# EAGLE design Payload (EAGLE 9.3.0)
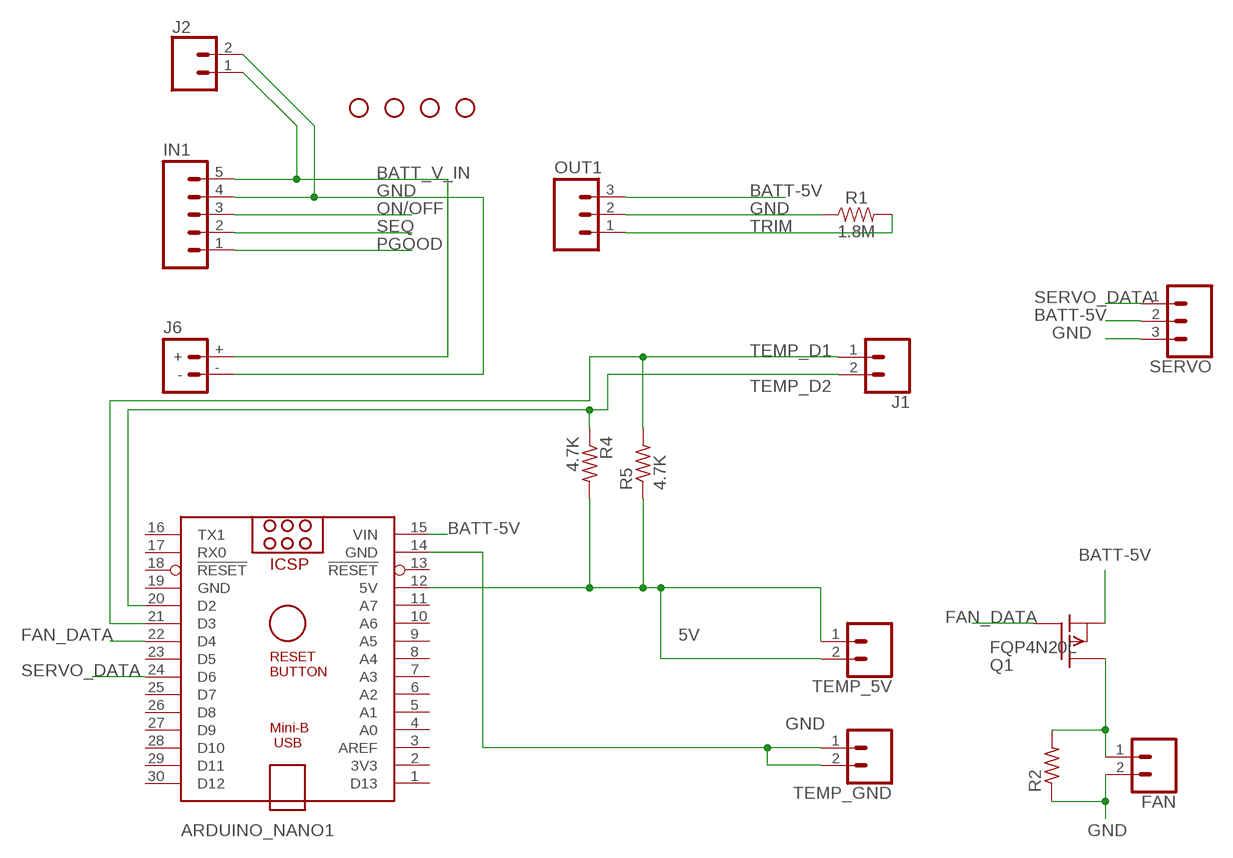
[diagram p0: schematic, sheet 1]

## Parts
ARDUINO_NANO1  ARDUINO_NANO  [ARDUINO_NANO]
FAN  CONN_023.5MM  [SCREWTERMINAL-3.5MM-2]
IN1  M05PTH  [1X05]
J1  CONN_023.5MM  [SCREWTERMINAL-3.5MM-2]
J2  CONN_023.5MM  [SCREWTERMINAL-3.5MM-2]
J6  BATTERY_CONN_DEANS  [DEANS]
OUT1  M03PTH  [1X03]
Q1  FQP4N20L  IRF9530  [TO220]
R1  1.8M  1.8MOHM  [0603]
R2  R-US_0207/10  [0207/10]
R4  4.7K  R-US_0207/10  [0207/10]
R5  4.7K  R-US_0207/10  [0207/10]
SERVO  CONN_03  [1X03]
TEMP_5V  CONN_023.5MM  [SCREWTERMINAL-3.5MM-2]
TEMP_GND  CONN_023.5MM  [SCREWTERMINAL-3.5MM-2]
U$2  STAND-OFF  [STAND-OFF]
U$6  STAND-OFF  [STAND-OFF]
U$7  STAND-OFF  [STAND-OFF]
U$8  STAND-OFF  [STAND-OFF]

## Nets
5V: ARDUINO_NANO1.12(5V) R4.2 R5.1 TEMP_5V.1 TEMP_5V.2
BATT-5V: ARDUINO_NANO1.15(VIN) OUT1.3 Q1.3(S) SERVO.2
BATT_V_IN: IN1.5 J2.1 J6.+
FAN_DATA: ARDUINO_NANO1.22(D4) Q1.1(G)
GND: ARDUINO_NANO1.14(GND) FAN.2 IN1.4 J2.2 J6.- OUT1.2 R1.1 R2.1 SERVO.3 TEMP_GND.1 TEMP_GND.2
N$2: FAN.1 Q1.2(D) R2.2
ON/OFF: IN1.3
PGOOD: IN1.1
SEQ: IN1.2
SERVO_DATA: ARDUINO_NANO1.24(D6) SERVO.1
TEMP_D1: ARDUINO_NANO1.21(D3) J1.1 R5.2
TEMP_D2: ARDUINO_NANO1.20(D2) J1.2 R4.1
TRIM: OUT1.1 R1.2
Unconnected: ARDUINO_NANO1.1(D13) ARDUINO_NANO1.2(3V3) ARDUINO_NANO1.3(AREF) ARDUINO_NANO1.4(A0) ARDUINO_NANO1.5(A1) ARDUINO_NANO1.6(A2) ARDUINO_NANO1.7(A3) ARDUINO_NANO1.8(A4) ARDUINO_NANO1.9(A5) ARDUINO_NANO1.10(A6) ARDUINO_NANO1.11(A7) ARDUINO_NANO1.13(!RESET) ARDUINO_NANO1.16(TX1) ARDUINO_NANO1.17(RX0) ARDUINO_NANO1.18(!RESET) ARDUINO_NANO1.23(D5) ARDUINO_NANO1.25(D7) ARDUINO_NANO1.26(D8) ARDUINO_NANO1.27(D9) ARDUINO_NANO1.28(D10) ARDUINO_NANO1.29(D11) ARDUINO_NANO1.30(D12)

## Power pins joined to a net without a drawn wire
GND: ARDUINO_NANO1.19(GND)

## Library data of the parts
ARDUINO_NANO1 = ArduinoNanoV30:ARDUINO_NANO: Arduino Nano V3.0 Overview: The Arduino Nano is a small, complete, and breadboard-friendly board based on the ATmega328 (Arduino Nano 3.x) or ATmega168 (Arduino Nano 2.x). It has more or less the same functionality of the Arduino Duemilanove, but in a different package. It lacks only a DC power jack, and works with a Mini-B USB cable instead of a standard one. The Nano was designed and is being produced by Gravitech. Specifications: Microcontroller Atmel ATmega168 or ATmega328 Operating Voltage (logic level) 5 V Input Voltage (recommended) 7-12 V Input Voltage (limits) 6-20 V Digital I/O Pins 14 (of which 6 provide PWM output) Analog Input Pins 8 DC Current per I/O Pin 40 mA Flash Memory 16 KB (ATmega168) or 32 KB (ATmega328) of which 2 KB used by bootloader SRAM 1 KB (ATmega168) or 2 KB (ATmega328) EEPROM 512 bytes (ATmega168) or 1 KB (ATmega328) Clock Speed 16 MHz Dimensions 0.73" x 1.70" Length 45 mm Width 18 mm Weigth 5 g Power: The Arduino Nano can be powered via the Mini-B USB connection, 6-20V unregulated external power supply (pin 30), or 5V regulated external power supply (pin 27). The power source is automatically selected to the highest voltage source. Memory: The ATmega168 has 16 KB of flash memory for storing code (of which 2 KB is used for the bootloader); the ATmega328 has 32 KB, (also with 2 KB used for the bootloader). The ATmega168 has 1 KB of SRAM and 512 bytes of EEPROM (which can be read and written with the EEPROM library); the ATmega328 has 2 KB of SRAM and 1 KB of EEPROM. Input and Output: Each of the 14 digital pins on the Nano can be used as an input or output, using pinMode(), digitalWrite(), and digitalRead() functions. They operate at 5 volts. Each pin can provide or receive a maximum of 40 mA and has an internal pull-up resistor (disconnected by default) of 20-50 kOhms. In addition, some pins have specialized functions. Visit Arduino - ArduinoBoardNano <https://www.arduino.cc/en/Main/ArduinoBoardNano>
FAN J1 J2 TEMP_5V TEMP_GND = SparkFun-Connectors:CONN_02: Multi connection point. Often used as Generic Header-pin footprint for 0.1 inch spaced/style header connections On any of the 0.1 inch spaced packages, you can populate with these: Break Away Headers - Straight <https://www.sparkfun.com/products/116> (PRT-00116) Break Away Male Headers - Right Angle <https://www.sparkfun.com/products/553> (PRT-00553) Female Headers <https://www.sparkfun.com/products/115> (PRT-00115) Break Away Headers - Machine Pin <https://www.sparkfun.com/products/117> (PRT-00117) Break Away Female Headers - Swiss Machine Pin <https://www.sparkfun.com/products/743> (PRT-00743) For SCREWTERMINALS and SPRING TERMINALS visit here: Screw Terimnals on SparkFun.com <https://www.sparkfun.com/search/results?term=Screw+Terminals> (5mm/3.5mm/2.54mm spacing) This device is also useful as a general connection point to wire up your design to another part of your project. Our various solder wires solder well into these plated through hole pads. Hook-Up Wire - Assortment (Stranded, 22 AWG) <https://www.sparkfun.com/products/11375> (PRT-11375) Hook-Up Wire - Assortment (Solid Core, 22 AWG) <https://www.sparkfun.com/products/11367> (PRT-11367) View the entire wire category on our website here <https://www.sparkfun.com/categories/141> Special notes: Molex polarized connector foot print use with: PRT-08233 with associated crimp pins and housings. 2.54_SCREWTERM for use with PRT-10571. 3.5mm Screw Terminal footprints for PRT-08084 5mm Screw Terminal footprints for use with PRT-08432; PROD_ID: CONN-08399
IN1 = SparkFun:M05: Header 5 Standard 5-pin 0.1" header. Use with straight break away headers (SKU : PRT-00116), right angle break away headers (PRT-00553), swiss pins (PRT-00743), machine pins (PRT-00117), and female headers (PRT-00115). Molex polarized connector foot print use with SKU : PRT-08230 with associated crimp pins and housings.
J6 = SparkFun-Connectors:BATTERY_CONN: Battery Connectors Various footprints for battery connections SparkFun Products: Deans Connector -M/F Pair <https://www.sparkfun.com/products/11864>; SF_ID: PRT-11864
OUT1 = SparkFun:M03: Header 3 Standard 3-pin 0.1" header. Use with straight break away headers (SKU : PRT-00116), right angle break away headers (PRT-00553), swiss pins (PRT-00743), machine pins (PRT-00117), and female headers (PRT-00115). Molex polarized connector foot print use with SKU : PRT-08232 with associated crimp pins and housings.
Q1 = transistor-fet:IRF9530: P-Channel Enhancement MOSFET (HEXFET); -100V; -12A; 0,3Ohm; SPICEPREFIX: Q
R1 = SparkFun-Resistors:1.8MOHM: 1.8 MOhms ±5% 0.1W, 1/10W Chip Resistor 0603; PROD_ID: RES-13994
R2 R4 R5 = rcl:R-US_: RESISTOR, American symbol; SPICEPREFIX: R
SERVO = SparkFun-Connectors:CONN_03: Multi connection point. Often used as Generic Header-pin footprint for 0.1 inch spaced/style header connections On any of the 0.1 inch spaced packages, you can populate with these: Break Away Headers - Straight <https://www.sparkfun.com/products/116> (PRT-00116) Break Away Male Headers - Right Angle <https://www.sparkfun.com/products/553> (PRT-00553) Female Headers <https://www.sparkfun.com/products/115> (PRT-00115) Break Away Headers - Machine Pin <https://www.sparkfun.com/products/117> (PRT-00117) Break Away Female Headers - Swiss Machine Pin <https://www.sparkfun.com/products/743> (PRT-00743) Stackable Header - 3 Pin (Female, 0.1") <https://www.sparkfun.com/products/13875> (PRT-13875) For SCREWTERMINALS and SPRING TERMINALS visit here: Screw Terimnals on SparkFun.com <https://www.sparkfun.com/search/results?term=Screw+Terminals> (5mm/3.5mm/2.54mm spacing) This device is also useful as a general connection point to wire up your design to another part of your project. Our various solder wires solder well into these plated through hole pads. Hook-Up Wire - Assortment (Stranded, 22 AWG) <https://www.sparkfun.com/products/11375> (PRT-11375) Hook-Up Wire - Assortment (Solid Core, 22 AWG) <https://www.sparkfun.com/products/11367> (PRT-11367) View the entire wire category on our website here <https://www.sparkfun.com/categories/141> Special notes: Molex polarized connector foot print use with SKU : PRT-08232 with associated crimp pins and housings.; PROD_ID: XXX-00000; VALUE: 455-1750-1-ND
U$2 U$6-U$8 = SparkFun:STAND-OFF: Stand Off This is the mechanical footprint for a #4 phillips button head screw. Use the keepout ring to avoid running the screw head into surrounding components. SKU : PRT-00447

## Board
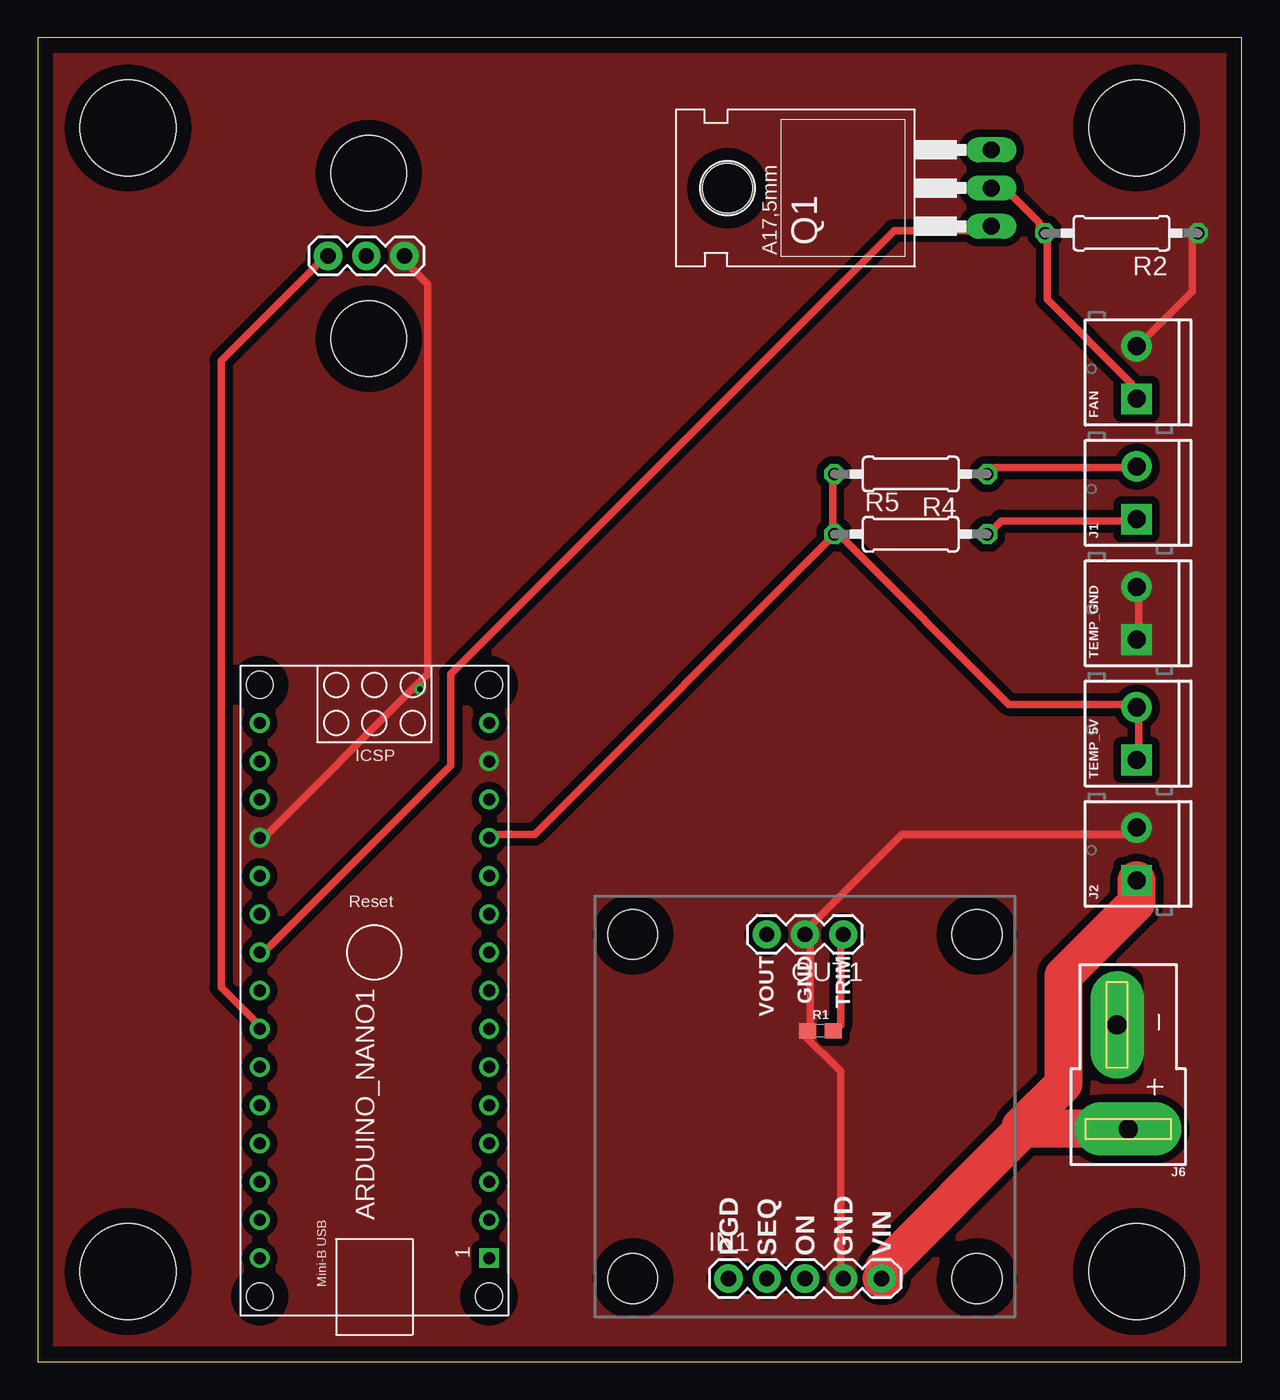
[diagram p1: board, top side]
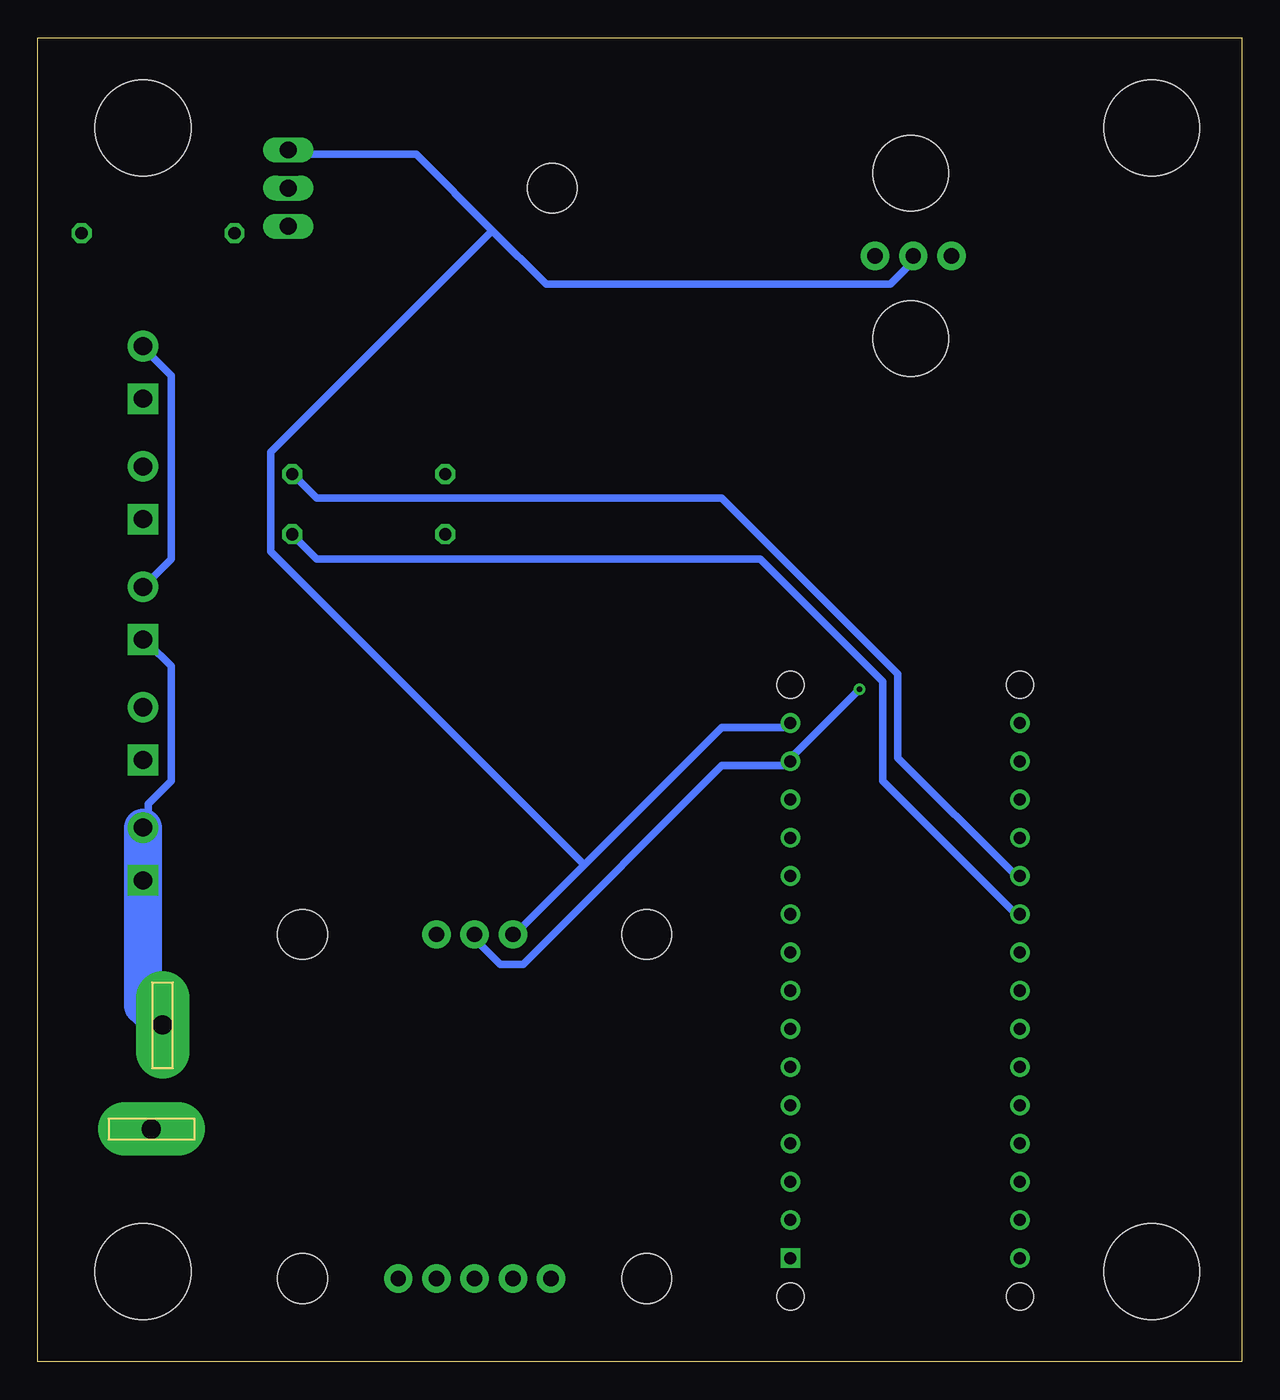
[diagram p2: board, bottom side, seen from below]

Size 80 x 88 mm. Coordinates in mm from the lower left corner, seen from the top.
Outline: 0,0 80,0 80,88 0,88 0,0
Copper layers (1*16): Top 0.035mm / dielectric 1.5mm / Bottom 0.035mm
Design rules "default *": minimum track width 20mil, minimum drill 0.35mm, track to track 20mil, track to pad 20mil, pad to pad 20mil, via to via 20mil, smd to smd 6mil, copper to edge 40mil, drill to drill 6mil, minimum pad ring 10mil, minimum via ring 8mil, stop-mask expansion 4mil, vias tented up to drill 0mil, thermal gap 10mil
Holes 5 mm at 22,79 22,68
Holes 6.35 mm at 6,82 73,82 73,6 6,6

### Footprints (pad centres in the part's own frame; a part is rotated, then mirrored left to right if it is on the bottom)
ARDUINO_NANO = drill 0.8 square: 1 -20.32,-7.62 | drill 0.8: 2 -17.78,-7.62; 3 -15.24,-7.62; 4 -12.7,-7.62; 5 -10.16,-7.62; 6 -7.62,-7.62; 7 -5.08,-7.62; 8 -2.54,-7.62; 9 0,-7.62; 10 2.54,-7.62; 11 5.08,-7.62; 12 7.62,-7.62; 13 10.16,-7.62; 14 12.7,-7.62; 15 15.24,-7.62; 16 15.24,7.62; 17 12.7,7.62; 18 10.16,7.62; 19 7.62,7.62; 20 5.08,7.62; 21 2.54,7.62; 22 0,7.62; 23 -2.54,7.62; 24 -5.08,7.62; 25 -7.62,7.62; 26 -10.16,7.62; 27 -12.7,7.62; 28 -15.24,7.62; 29 -17.78,7.62; 30 -20.32,7.62 | hole 1.778: -22.86,-7.62; -22.86,7.62; 17.78,7.62; 17.78,-7.62
SCREWTERMINAL-3.5MM-2 = drill 1.2 pad 2.032 square: 1 0,0 | drill 1.2 pad 2.032: 2 3.5,0
1X05 = drill 1.016 pad 1.88: 1 0,0; 2 2.54,0; 3 5.08,0; 4 7.62,0; 5 10.16,0
DEANS = drill 1.27 pad 3.556 long: + 0,0; - 0.737,-6.921
1X03 = drill 1.016 pad 1.88: 1 0,0; 2 2.54,0; 3 5.08,0
TO220 = drill 1.118 long: 1 -2.54,-6.35; 2 0,-6.35; 3 2.54,-6.35 | hole 3.302: 0,11.176
0603 = smd 1.1 x 1: 1 -0.85,0; 2 0.85,0
0207/10 = drill 0.813 octagon: 1 -5.08,0; 2 5.08,0
STAND-OFF = hole 3.302: 0,0

### Placement (x,y rotation side)
ARDUINO_NANO1  22.37,27.21 90 top
FAN  73,64 90 top
IN1  45.89,5.54 0 top
J1  73,56 90 top
J2  73,32 90 top
J6  72.44,15.47 180 top
OUT1  53.51,28.4 180 top
Q1  57,78 90 top
R1  52,22 0 top
R2  72,75 180 top
R4  58,59 180 top
R5  58,55 0 top
SERVO  19.29,73.5 0 top
TEMP_5V  73,40 90 top
TEMP_GND  73,48 90 top
U$2  39.54,5.54 0 top
U$6  62.4,5.54 0 top
U$7  39.54,28.4 0 top
U$8  62.4,28.4 0 top

### Tracks (layer width: path | path; a pad name or v marks a point on that pad's centre or on a via)
5V
  Top 0.508: TEMP_5V.1 73.15,40.13 73.15,43.18 TEMP_5V.2 72.64,43.69 64.52,43.69 53.34,54.86 R5.1 | ARDUINO_NANO1.12 30.48,35.05 33.02,35.05 52.83,54.86 R5.1 | R4.2 52.83,58.93 52.83,55.37 R5.1
BATT-5V
  Bottom 0.508: 43.69,33.02 48.26,28.45 OUT1.3 | 43.69,33.02 34.54,42.16 30.48,42.16 ARDUINO_NANO1.15 | 49.78,75.18 46.23,71.63 23.37,71.63 21.84,73.15 SERVO.2 | 49.78,75.18 54.86,80.26 62.99,80.26 Q1.3 | 43.69,33.02 64.52,53.85 64.52,60.45 49.78,75.18
BATT_V_IN
  Top 0.508: 56.39,5.59 IN1.5
  Top 2.54: J6.+ 65.48,15.47 | 65.48,15.47 65.3,15.65 68.15,18.49 68.15,25.68 73,30.53 J2.1 | 65.48,15.47 56.23,6.22 56.23,5.72 | 56.23,5.72 56.23,5.54 | IN1.5 56.23,5.72
FAN_DATA
  Top 0.508: ARDUINO_NANO1.22 15.24,27.43 27.43,39.62 27.43,45.72 56.9,75.18 62.99,75.18 Q1.1
GND  (via drill 0.35)
  Top 0.508: 24.89,44.7 25.91,45.72 25.91,71.63 24.38,73.15 SERVO.3 | 24.89,44.7 15.24,35.05 ARDUINO_NANO1.19 | R2.1 76.71,74.68 76.71,71.12 73.15,67.56 FAN.2 | TEMP_GND.2 73.15,51.31 73.15,48.26 TEMP_GND.1 | IN1.4 53.34,5.59 53.34,19.3 50.8,21.84 R1.1 51.31,22.35 51.31,27.94 OUT1.2 50.8,28.45 57.4,35.05 72.64,35.05 J2.2 | v25.4,44.7 24.89,44.7
  Bottom 0.508: J2.2 72.64,35.56 72.64,37.08 71.12,38.61 71.12,46.23 72.64,47.75 TEMP_GND.1 | FAN.2 72.64,67.06 71.12,65.53 71.12,53.34 72.64,51.82 TEMP_GND.2 | OUT1.2 50.8,27.94 49.28,26.42 47.75,26.42 34.54,39.62 30.48,39.62 ARDUINO_NANO1.14 29.97,40.13 v25.4,44.7
  Bottom 2.54: J6.- 73,23.69 J2.2
  pour Top (rank 4, no thermals): 0,88 80,88 80,0 1,0 0,0
N$2
  Top 0.508: Q1.2 63.5,77.72 64.52,77.72 66.55,75.69 66.55,75.18 R2.2 67.06,74.68 67.06,70.61 72.64,65.02 72.64,64.01 FAN.1
SERVO_DATA
  Top 0.508: ARDUINO_NANO1.24 14.73,22.35 12.19,24.89 12.19,66.55 18.8,73.15 SERVO.1
TEMP_D1
  Top 0.508: J1.1 72.64,55.88 64.01,55.88 63.5,55.37 R5.2
  Bottom 0.508: ARDUINO_NANO1.21 15.24,29.97 23.88,38.61 23.88,45.21 32,53.34 61.47,53.34 62.99,54.86 R5.2
TEMP_D2
  Top 0.508: J1.2 72.64,59.44 63.5,59.44 R4.1
  Bottom 0.508: ARDUINO_NANO1.20 15.24,32.51 22.86,40.13 22.86,45.72 34.54,57.4 61.47,57.4 62.99,58.93 R4.1
TRIM
  Top 0.508: R1.2 53.34,22.35 53.34,27.94 OUT1.1

### Text on the board
tPlace: VOUT | GND | TRIM | PGD | SEQ | ON | GND | VIN